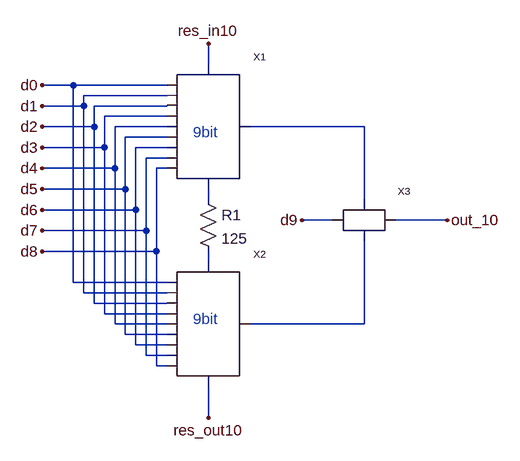
[diagram p0: schematic level9.asc]
level9.asc, the LTspice schematic file:
Version 4
SHEET 1 880 724
WIRE 176 16 176 -16
WIRE -32 48 -80 48
WIRE 112 48 -32 48
WIRE 112 64 -16 64
WIRE -16 80 -16 64
WIRE -16 80 -80 80
WIRE 112 80 0 80
WIRE 112 96 16 96
WIRE 0 112 0 80
WIRE 0 112 -80 112
WIRE 112 112 32 112
WIRE 416 112 240 112
WIRE 112 128 48 128
WIRE 16 144 16 96
WIRE 16 144 -80 144
WIRE 112 144 64 144
WIRE 112 160 80 160
WIRE 32 176 32 112
WIRE 32 176 -80 176
WIRE 112 176 96 176
WIRE 48 208 48 128
WIRE 48 208 -80 208
WIRE 176 224 176 208
WIRE 416 224 416 112
WIRE 64 240 64 144
WIRE 64 240 -80 240
WIRE 368 256 320 256
WIRE 544 256 464 256
WIRE 80 272 80 160
WIRE 80 272 -80 272
WIRE 96 304 96 176
WIRE 96 304 -80 304
WIRE 176 320 176 304
WIRE -32 352 -32 48
WIRE 112 352 -32 352
WIRE -16 368 -16 80
WIRE 112 368 -16 368
WIRE 0 384 0 112
WIRE 112 384 0 384
WIRE 16 400 16 144
WIRE 112 400 16 400
WIRE 32 416 32 176
WIRE 112 416 32 416
WIRE 416 416 416 288
WIRE 416 416 240 416
WIRE 48 432 48 208
WIRE 112 432 48 432
WIRE 64 448 64 240
WIRE 112 448 64 448
WIRE 80 464 80 272
WIRE 112 464 80 464
WIRE 96 480 96 304
WIRE 112 480 96 480
WIRE 176 560 176 512
FLAG -80 48 d0
FLAG -80 80 d1
FLAG -80 112 d2
FLAG -80 144 d3
FLAG -80 176 d4
FLAG -80 208 d5
FLAG -80 240 d6
FLAG -80 272 d7
FLAG -80 304 d8
FLAG 320 256 d9
FLAG 544 256 out_10
FLAG 176 -16 res_in10
FLAG 176 560 res_out10
SYMBOL level8 176 96 R0
SYMATTR InstName X1
SYMBOL level8 176 400 R0
SYMATTR InstName X2
SYMBOL switch 416 256 R0
SYMATTR InstName X3
SYMBOL res 160 208 R0
SYMATTR InstName R1
SYMATTR Value 125
TEXT 152 120 Left 2 ;9bit
TEXT 152 408 Left 2 ;9bit

The netlist it stands for:
* level9.asc
XX1 d0 d1 d2 d3 d4 d5 d6 d7 d8 res_in10 N002 N001 level8  ; pins d0 d1 d2 d3 d4 d5 d6 d7 d8 res_in9 res_out9 out_9
XX2 d0 d1 d2 d3 d4 d5 d6 d7 d8 N003 res_out10 N004 level8  ; pins d0 d1 d2 d3 d4 d5 d6 d7 d8 res_in9 res_out9 out_9
XX3 d9 N001 N004 out_10 switch  ; pins dig_in in_1 in_2 Vout
R1 N002 N003 125
* 9bit
* 9bit
.backanno
.end